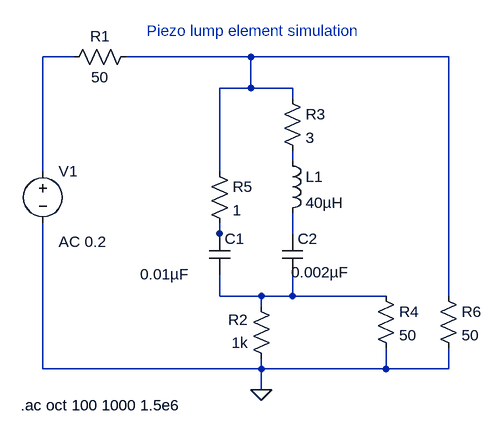
[diagram p0: schematic Piezo stack simulation.asc]
Piezo stack simulation.asc, the LTspice schematic file:
Version 4
SHEET 1 1032 680
WIRE -128 -16 -176 -16
WIRE 144 -16 -48 -16
WIRE 448 -16 144 -16
WIRE 144 32 144 -16
WIRE 144 32 96 32
WIRE 208 32 144 32
WIRE 208 48 208 32
WIRE 208 144 208 128
WIRE -176 160 -176 -16
WIRE 96 160 96 32
WIRE 96 256 96 240
WIRE 208 256 208 224
WIRE 96 272 96 256
WIRE 96 352 96 320
WIRE 160 352 96 352
WIRE 208 352 208 320
WIRE 208 352 160 352
WIRE 352 352 208 352
WIRE 448 352 448 -16
WIRE 160 368 160 352
WIRE -176 464 -176 240
WIRE 160 464 160 448
WIRE 160 464 -176 464
WIRE 352 464 352 432
WIRE 352 464 160 464
WIRE 448 464 448 432
WIRE 448 464 352 464
WIRE 160 496 160 464
FLAG 160 496 0
SYMBOL voltage -176 144 R0
WINDOW 123 24 124 Left 2
WINDOW 39 0 0 Left 0
SYMATTR InstName V1
SYMATTR Value ""
SYMATTR Value2 AC 0.2
SYMBOL res -32 -32 R90
WINDOW 0 0 56 VBottom 2
WINDOW 3 32 56 VTop 2
SYMATTR InstName R1
SYMATTR Value 50
SYMBOL res 176 464 R180
WINDOW 0 36 76 Left 2
WINDOW 3 36 40 Left 2
SYMATTR InstName R2
SYMATTR Value 1k
SYMBOL ind 192 128 R0
SYMATTR InstName L1
SYMATTR Value 40µH
SYMBOL cap 80 256 R0
WINDOW 3 -106 62 Left 2
SYMATTR InstName C1
SYMATTR Value 0.01µF
SYMBOL res 336 336 R0
SYMATTR InstName R4
SYMATTR Value 50
SYMBOL res 432 336 R0
SYMATTR InstName R6
SYMATTR Value 50
SYMBOL cap 192 256 R0
WINDOW 3 14 59 Left 2
SYMATTR InstName C2
SYMATTR Value 0.002µF
SYMBOL res 192 32 R0
SYMATTR InstName R3
SYMATTR Value 3
SYMBOL res 80 144 R0
SYMATTR InstName R5
SYMATTR Value 1
TEXT -210 520 Left 2 !.ac oct 100 1000 1.5e6
TEXT -16 -56 Left 2 ;Piezo lump element simulation

The netlist it stands for:
* Piezo stack simulation.asc
V1 N001 0 AC 0.2
R1 N002 N001 50
R2 0 N006 1k
L1 N003 N005 40µH
C1 N004 N006 0.01µF
R4 N006 0 50
R6 N002 0 50
C2 N005 N006 0.002µF
R3 N002 N003 3
R5 N002 N004 1
.ac oct 100 1000 1.5e6
* Piezo lump element simulation
.backanno
.end